# EAGLE design Barcode_Interface (EAGLE 5.10)
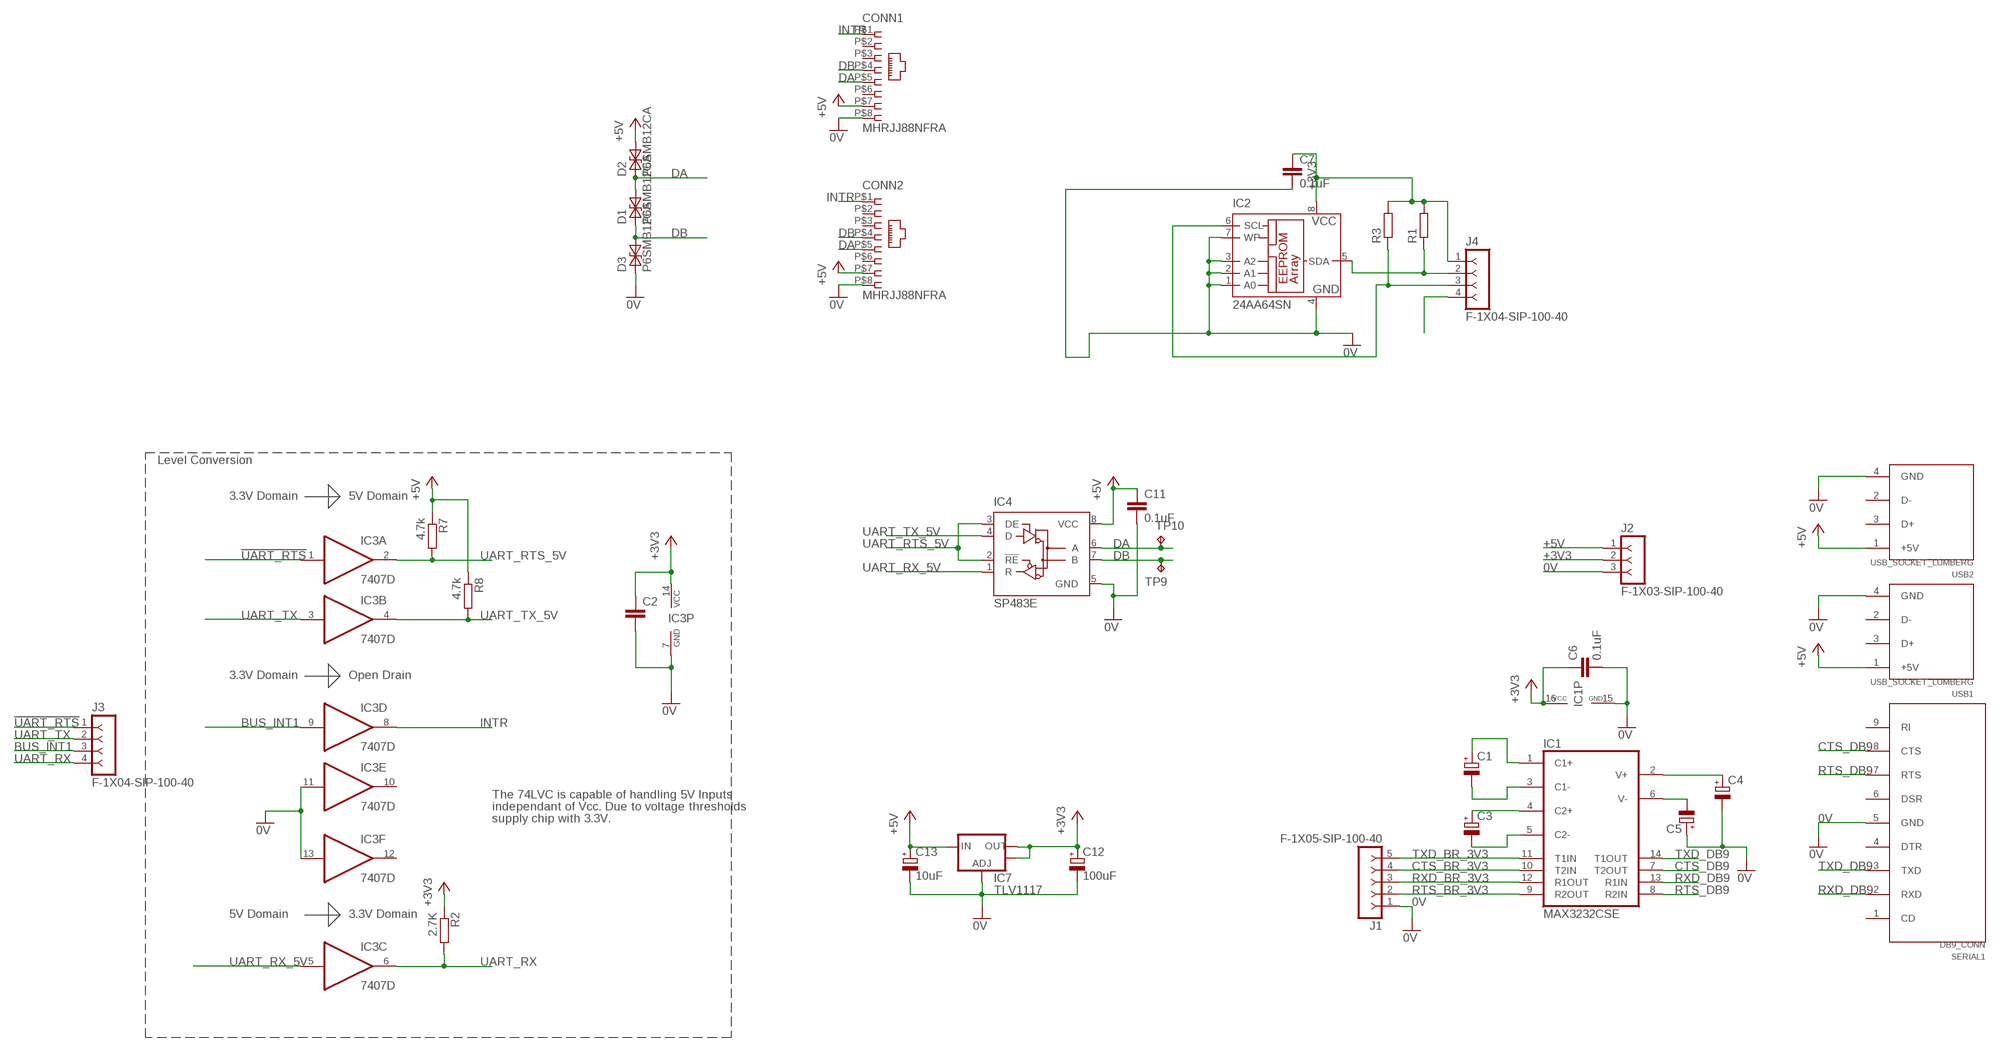
[diagram p0: schematic, sheet 1]

## Parts
C1  CPOL-EUE3.5-8  [E3,5-8]
C2  C-EUC0603  [C0603]
C3  CPOL-EUE3.5-8  [E3,5-8]
C4  CPOL-EUE3.5-8  [E3,5-8]
C5  CPOL-EUE3.5-8  [E3,5-8]
C6  0.1uF  C-EUC1206  [C1206]
C7  0.1uF  C-EUC1206  [C1206]
C11  0.1uF  C-EUC1206  [C1206]
C12  100uF  CPOL-EUB/3528-21R  [B/3528-21R]
C13  10uF  CPOL-EUC/6032-28R  [C/6032-28R]
CONN1  MHRJJ88NFRA  [MHRJJ8NFRA]
CONN2  MHRJJ88NFRA  [MHRJJ8NFRA]
D1  P6SMB12CA  [SMB]
D2  P6SMB12CA  [SMB]
D3  P6SMB12CA  [SMB]
IC1  MAX3232CSE  [SO16]
IC2  24AA64SN  [SO-08]
IC3  7407D  [SO14]
IC4  SP483E  75176AD  [D_R-PDSO-G8]
IC7  TLV1117  V_REG_LM1117SOT223  [SOT223]
J1  F-1X05-SIP-100-40  [SIP-100-05-40]
J2  F-1X03-SIP-100-40  [SIP-100-03-40]
J3  F-1X04-SIP-100-40  [SIP-100-04-40]
J4  F-1X04-SIP-100-40  [SIP-100-04-40]
R1  R-EU_R0805  [R0805]
R2  2.7K  R-EU_R0805  [R0805]
R3  R-EU_R0805  [R0805]
R7  4.7k  R-EU_R0805  [R0805]
R8  4.7k  R-EU_R0805  [R0805]
SERIAL1  DB9_CONN  [DB9]
TP9  TPTP13R  [TP13R]
TP10  TPTP13R  [TP13R]
USB1  USB_SOCKET_LUMBERG  [USB_SOCKET_LUMBERG]
USB2  USB_SOCKET_LUMBERG  [USB_SOCKET_LUMBERG]

## Nets
0V: C2.2 C4.- C5.+ C6.2 C7.2 C11.2 C12.- C13.- CONN1.P$8 CONN2.P$8 D3.1 IC1.15(GND) IC2.1(A0) IC2.2(A1) IC2.3(A2) IC2.4(GND) IC2.7(WP) IC3.7(P:GND) IC3.11(E:I) IC3.13(F:I) IC4.5(GND) IC7.1(ADJ) J1.1 J2.3 SERIAL1.5(GND) USB1.4(GND) USB2.4(GND)
!UART_RTS!: IC3.1(A:I) J3.1
+3V3: C2.1 C6.1 C7.1 C12.+ IC1.16(VCC) IC2.8(VCC) IC3.14(P:VCC) IC7.2(OUT) IC7.4(OUT) J2.2 J4.1 R1.2 R2.1 R3.2
+5V: C11.1 C13.+ CONN1.P$7 CONN2.P$7 D2.2 IC4.8(VCC) IC7.3(IN) J2.1 R7.1 R8.1 USB1.1(+5V) USB2.1(+5V)
BUS_INT1: IC3.9(D:I) J3.3
CTS_BR_3V3: IC1.10(T2IN) J1.4
CTS_DB9: IC1.7(T2OUT) SERIAL1.8(CTS)
DA: CONN1.P$5 CONN2.P$5 D1.2 D2.1 IC4.6(A) TP10.TP
DB: CONN1.P$4 CONN2.P$4 D1.1 D3.2 IC4.7(B) TP9.TP
INTR: CONN1.P$1 CONN2.P$1 IC3.8(D:O)
N$1: C1.+ IC1.1(C1+)
N$2: C1.- IC1.3(C1-)
N$3: C3.+ IC1.4(C2+)
N$4: C3.- IC1.5(C2-)
N$5: IC2.5(SDA) J4.2 R1.1
N$6: IC2.6(SCL) J4.3 R3.1
N$7: C5.- IC1.6(V-)
N$8: C4.+ IC1.2(V+)
N$9: J4.4
RTS_BR_3V3: IC1.9(R2OUT) J1.2
RTS_DB9: IC1.8(R2IN) SERIAL1.7(RTS)
RXD_BR_3V3: IC1.12(R1OUT) J1.3
RXD_DB9: IC1.13(R1IN) SERIAL1.2(RXD)
TXD_BR_3V3: IC1.11(T1IN) J1.5
TXD_DB9: IC1.14(T1OUT) SERIAL1.3(TXD)
UART_RTS_5V: IC3.2(A:O) IC4.2(!RE) IC4.3(DE) R7.2
UART_RX: IC3.6(C:O) J3.4 R2.2
UART_RX_5V: IC3.5(C:I) IC4.1(R)
UART_TX: IC3.3(B:I) J3.2
UART_TX_5V: IC3.4(B:O) IC4.4(D) R8.2
Unconnected: CONN1.P$2 CONN1.P$3 CONN1.P$6 CONN2.P$2 CONN2.P$3 CONN2.P$6 IC3.10(E:O) IC3.12(F:O) SERIAL1.1(CD) SERIAL1.4(DTR) SERIAL1.6(DSR) SERIAL1.9(RI) USB1.2(D-) USB1.3(D+) USB2.2(D-) USB2.3(D+)

## Notes on the sheet
- Level Conversion
- 3.3V Domain | 5V Domain
- 3.3V Domain | Open Drain
- The 74LVC is capable of handling 5V Inputs
- independant of Vcc. Due to voltage thresholds
- supply chip with 3.3V.
- 5V Domain | 3.3V Domain

## Library data of the parts
C1 C3-C5 C12 C13 = resistor:CPOL-EU: POLARIZED CAPACITOR, European symbol
C2 C6 C7 C11 = resistor:C-EU: CAPACITOR, European symbol
CONN1 CONN2 = eko-parts:MHRJJ88NFRA: http://onecall.farnell.com/mh-connectors/mhrjj88nfra/socket-rj45-8p8c/dp/3938360
D1-D3 = _hhn_suppressor_SMAJ_SM6T_P6SMB:P6SMB*CA: P6SMBxxCA Series of bidirectional Transient Voltage Suppressor Diodes xx = Stand-off Voltage VR in Volts; PPmax = 600 W Case: SMB = DO 214 AA Note: Footprint acc. to ST specs; source: www.st.com Author: Dipl.-Ing. FH Rainer Bayer, www.ing-rb.de/hhn Feedback: rainer.bayer@hs-heilbronn.de
IC1 = maxim:MAX3232*: True RS-232 Transceivers 3.0V to 5.5V, Low-Power up to 1Mbps, Using Four 0.1µF External Capacitors Source: http://pdfserv.maxim-ic.com/en/ds/MAX3222-MAX3241.pdf
IC2 = microchip:24*: Serial EEPROM I2C
IC3 = 74xx-eu:74*07: Hex BUFFER, open collector high-voltage output
IC4 = 751xx:75176A: DIFFERENTIAL BUS TRANSCEIVER Source: http://focus.ti.com/lit/ds/symlink/sn75176a.pdf
IC7 = SparkFun:V_REG_LM1117: Voltage Regulator LM1117 Standard adjustable voltage regulator but in SMD form. Spark Fun Electronics SKU : COM-00595
J1 = con-headers-jp:F-1X05-: FEMALE HEADER
J2 = con-headers-jp:F-1X03-: FEMALE HEADER
J3 J4 = con-headers-jp:F-1X04-: FEMALE HEADER
R1-R3 R7 R8 = resistor:R-EU_: RESISTOR, European symbol
SERIAL1 = eko-parts:DB9_CONN
TP9 TP10 = testpad:TP: Test pad
USB1 USB2 = eko-parts:USB_SOCKET_LUMBERG: http://www.farnell.com/datasheets/57298.pdf http://onecall.farnell.com/lumberg/2410-06/socket-usb-type-a/dp/1308874

## Board
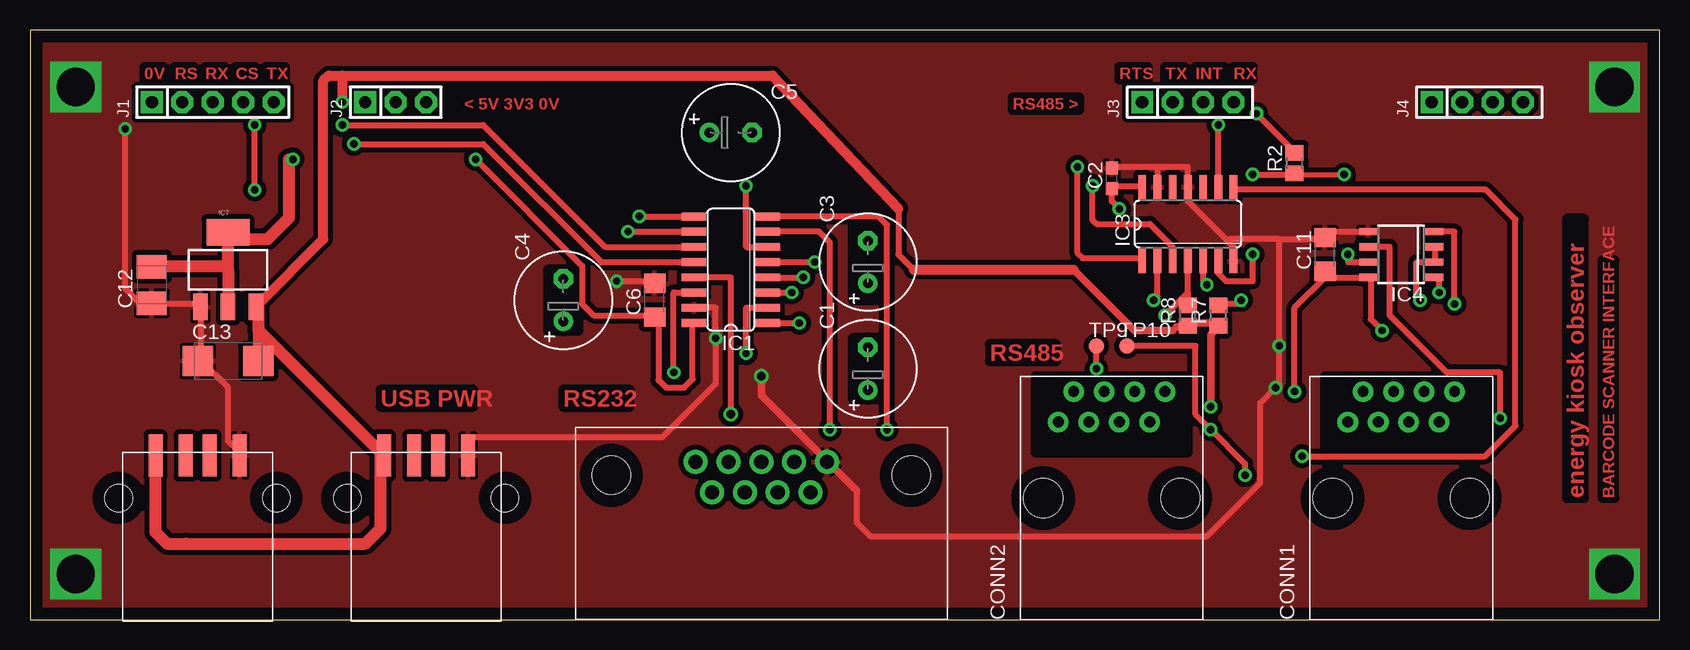
[diagram p1: board, top side]
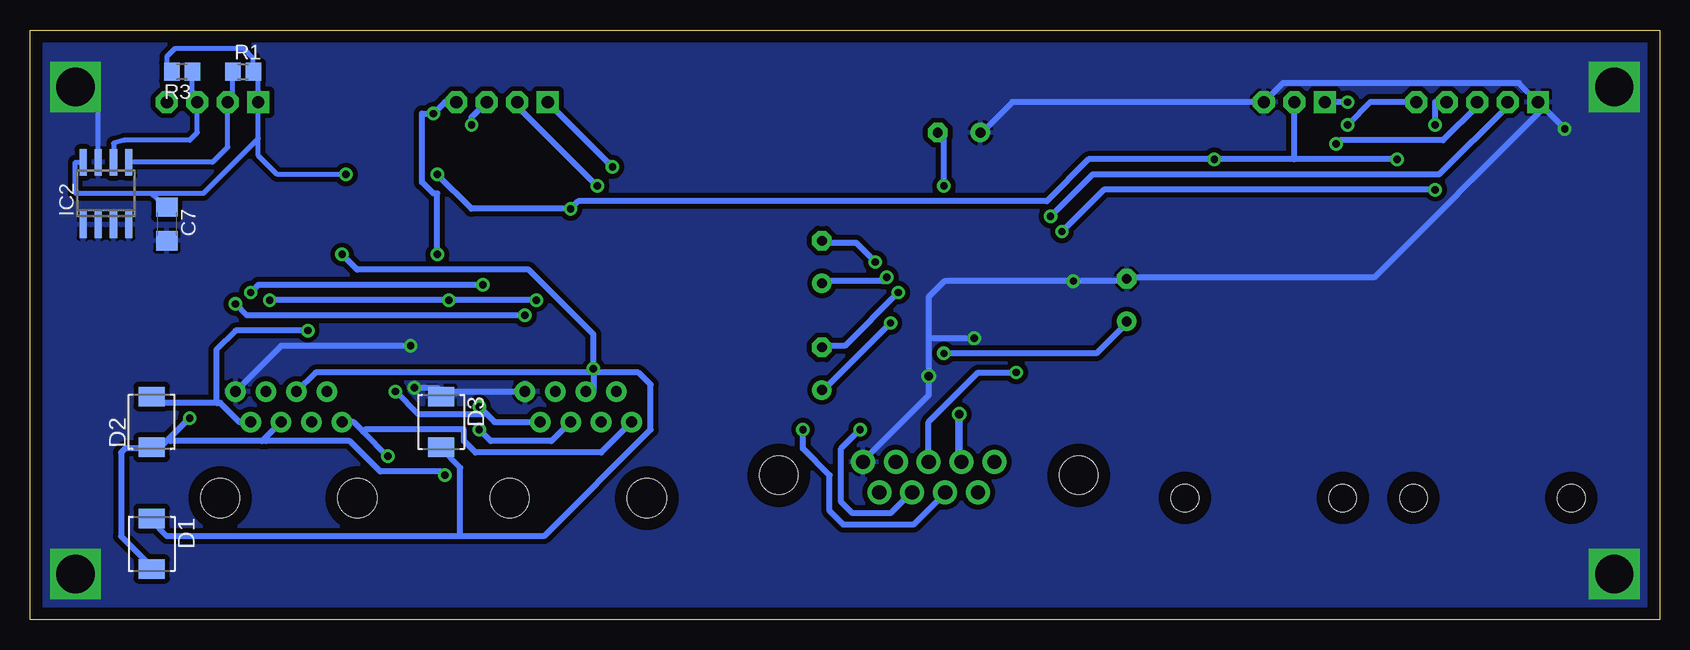
[diagram p2: board, bottom side, seen from below]

Size 135.87 x 49.2 mm. Coordinates in mm from the lower left corner, seen from the top.
Outline: 0,0 135.87,0 135.87,49.2 0,49.2 0,0
Copper layers (1*16): Top 0.035mm / dielectric 1.5mm / Bottom 0.035mm
Design rules "default *": minimum track width 16mil, minimum drill 24mil, track to track 16mil, track to pad 16mil, pad to pad 16mil, via to via 16mil, smd to smd 8mil, copper to edge 40mil, drill to drill 8mil, minimum pad ring 16mil, minimum via ring 10mil, stop-mask expansion 4mil, vias tented up to drill 0mil, thermal gap 10mil
tRestrict: area 83.8,14 to 96.5,20.3; area 108,14 to 120.7,20.3; area 68.6,26.7 to 71.1,33; area 43.2,24.1 to 45.7,29.2; area 68.6,18.4 to 71.1,23.5; area 55.9,39.4 to 61,41.9; area 91.4,41.9 to 101.6,44.5; area 26.7,41.9 to 34.3,44.5; area 8.9,41.9 to 21.6,44.5
vRestrict: area 26.7,0 to 39.4,14; area 7.6,0 to 20.3,14; area 82.5,0 to 97.8,20.3; area 106.7,0 to 121.9,20.3; area 57.2,24.1 to 59.7,34.3; area 91.4,31.7 to 101.6,34.3; area 111.8,27.9 to 116.8,33; area 66,16.5 to 73.7,25.4; area 66,25.4 to 73.7,34.3; area 39.4,22.9 to 48.3,30.5; area 53.3,36.8 to 62.2,44.5; area 12.7,27.9 to 20.3,30.5

### Footprints (pad centres in the part's own frame; a part is rotated, then mirrored left to right if it is on the bottom)
E3,5-8 = drill 0.813 pad 1.6 round: + -1.778,0 | drill 0.813 pad 1.6 octagon: - 1.778,0
C0603 = smd 1.1 x 1: 1 -0.85,0; 2 0.85,0
C1206 = smd 1.6 x 1.8: 1 -1.4,0; 2 1.4,0
B/3528-21R = smd 1.95 x 2.5: + 1.525,0; - -1.525,0
C/6032-28R = smd 2.55 x 2.5: + 2.525,0; - -2.525,0
MHRJJ8NFRA = drill 0.9 round: P$1 -4.445,6.35; P$2 -3.175,8.89; P$3 -1.905,6.35; P$4 -0.635,8.89; P$5 0.635,6.35; P$6 1.905,8.89; P$7 3.175,6.35; P$8 4.445,8.89 | hole 3.25: -5.715,0; 5.715,0
SMB = smd 1.62 x 2.18: 1 -2.11,0; 2 2.11,0
SO16 = smd 0.66 x 2.032: 1 -4.445,-3.073; 2 -3.175,-3.073; 3 -1.905,-3.073; 4 -0.635,-3.073; 5 0.635,-3.073; 6 1.905,-3.073; 7 3.175,-3.073; 8 4.445,-3.073; 9 4.445,3.073; 10 3.175,3.073; 11 1.905,3.073; 12 0.635,3.073; 13 -0.635,3.073; 14 -1.905,3.073; 15 -3.175,3.073; 16 -4.445,3.073
SO-08 = smd 0.6 x 2.2: 1 -1.905,-2.6; 2 -0.635,-2.6; 3 0.635,-2.6; 4 1.905,-2.6; 5 1.905,2.6; 6 0.635,2.6; 7 -0.635,2.6; 8 -1.905,2.6
SO14 = smd 0.66 x 2.032: 1 -3.81,-3.073; 2 -2.54,-3.073; 3 -1.27,-3.073; 4 0,-3.073; 5 1.27,-3.073; 6 2.54,-3.073; 7 3.81,-3.073; 8 3.81,3.073; 9 2.54,3.073; 10 1.27,3.073; 11 0,3.073; 12 -1.27,3.073; 13 -2.54,3.073; 14 -3.81,3.073
D_R-PDSO-G8 = smd 0.6 x 1.5: 1 -1.905,-2.75; 2 -0.635,-2.75; 3 0.635,-2.75; 4 1.905,-2.75; 5 1.905,2.75; 6 0.635,2.75; 7 -0.635,2.75; 8 -1.905,2.75
SOT223 = smd 1.219 x 2.235: 1 -2.311,-3.099; 2 0,-3.099; 3 2.311,-3.099 | smd 3.6 x 2.2: 4 0,3.099
SIP-100-05-40 = drill 1.016 pad 1.778 square: 1 -5.08,0 | drill 1.016 pad 1.778 octagon: 2 -2.54,0; 3 0,0; 4 2.54,0; 5 5.08,0
SIP-100-03-40 = drill 1.016 pad 1.778 square: 1 -2.54,0 | drill 1.016 pad 1.778 octagon: 2 0,0; 3 2.54,0
SIP-100-04-40 = drill 1.016 pad 1.778 square: 1 -3.81,0 | drill 1.016 pad 1.778 octagon: 2 -1.27,0; 3 1.27,0; 4 3.81,0
R0805 = smd 1.3 x 1.5: 1 -0.85,0; 2 0.85,0
DB9 = drill 1.19 round: 1 5.48,-1.12; 2 2.74,-1.12; 3 0,-1.12; 4 -2.74,-1.12; 5 -5.48,-1.12; 6 4.11,1.42; 7 1.37,1.42; 8 -1.37,1.42; 9 -4.11,1.42 | hole 3.2: -12.5,0; 12.5,0
TP13R = smd 1.3 x 1.3: TP 0,0
USB_SOCKET_LUMBERG = smd 1.15 x 3.5: 1 -3.5,3.56; 2 -1,3.56; 3 1,3.56; 4 3.5,3.56 | hole 2.3: -6.57,0; 6.57,0

### Placement (x,y rotation side)
C1  69.85,20.95 90 top
C2  90.17,36.83 90 top
C3  69.85,29.84 90 top
C4  44.45,26.67 90 top
C5  58.42,40.64 0 top
C6  52.07,26.67 90 top
C7  124.46,33.02 270 bottom
C11  107.95,30.48 90 top
C12  10.16,27.94 90 top
C13  16.51,21.59 0 top
CONN1  114.3,10.16 0 top
CONN2  90.17,10.16 0 top
D1  125.73,6.35 270 bottom
D2  125.73,16.51 90 bottom
D3  101.6,16.51 270 bottom
IC1  58.42,29.21 90 top
IC2  129.54,35.56 0 bottom
IC3  96.52,33.02 0 top
IC4  114.3,30.48 90 top
IC7  16.51,29.21 0 top
J1  15.24,43.18 0 top
J2  30.48,43.18 0 top
J3  96.52,43.18 0 top
J4  120.65,43.18 0 top
R1  118.11,45.72 0 bottom
R2  105.41,38.1 90 top
R3  123.19,45.72 180 bottom
R7  99.06,25.4 90 top
R8  96.52,25.4 90 top
SERIAL1  60.96,12.06 180 top
TP9  88.9,22.86 0 top
TP10  91.44,22.86 0 top
USB1  13.97,10.16 0 top
USB2  33.02,10.16 0 top

### Tracks (layer width: path | path; a pad name or v marks a point on that pad's centre or on a via)
0V  (via drill 0.61, 0.7, 3.2)
  Top 0.508: 14.29,21.59 14.29,26.04 IC7.1 13.97,26.35 10.16,26.35 C12.- 10.16,26.67 8.89,26.67 7.94,27.62 v7.94,40.96 | 14.29,21.59 16.51,19.37 16.51,14.92 17.46,13.97 USB1.4 | 14.29,21.59 C13.- | 93.98,37.78 90.17,37.78 C2.2 | 93.98,37.78 IC3.13 | IC4.5 107.95,32.38 C11.2 107.95,31.75 104.14,31.75 | 99.85,31.59 100.33,31.11 IC3.7 | 99.85,31.59 96.52,34.92 IC3.11 96.52,37.78 93.98,37.78 | 104.14,31.75 100.01,31.75 99.85,31.59 | 104.14,31.75 v104.14,22.86 104.14,19.68 v103.82,19.37 102.55,18.1 102.55,11.43 98.11,6.99 70.04,6.99 68.9,8.13 68.9,10.79 | IC1.15 57.15,26.04 v57.15,23.5 57.15,19.68 52.7,15.24 36.83,15.24 36.83,13.97 USB2.4 | v48.9,28.26 52.07,28.26 C6.2
  Top 0.61: v60.96,20.32 60.96,18.73 68.9,10.79
  Bottom 0.406: IC2.7 130.18,42.55 132.08,42.55 v132.08,44.45
  Bottom 0.508: C5.+ 56.52,40.64 53.98,43.18 J2.3 31.43,44.77 11.75,44.77 J1.1 | v7.94,40.96 J1.1 | CONN2.P$8 101.28,19.05 101.6,18.73 D3.1 101.6,19.05 101.92,19.37 v103.82,19.37 | CONN1.P$8 114.94,22.86 v104.14,22.86 | 60.96,23.5 v60.96,20.32 60.96,18.73 66.36,13.34 SERIAL1.5 | 60.96,23.5 60.96,26.95 59.65,28.26 v48.9,28.26 44.45,28.26 C4.- 44.45,28.57 23.81,28.57 9.84,42.55 J1.1 | 60.96,23.5 v57.15,23.5
  other vias: 3.81,44.45 3.81,3.81 132.08,3.81
  pour Bottom (isolate 0.406): 0,49.53 135.89,49.53 135.89,0 0,0
  pour Top (isolate 0.406): 0,49.53 135.89,49.53 135.89,0 0,0
!UART_RTS!  (via drill 0.61)
  Top 0.508: v87.31,37.78 87.31,30.61 87.76,30.16 92.71,30.16 IC3.1
  Bottom 0.508: v87.31,37.78 J3.1
+3V3  (via drill 0.61)
  Top 0.406: 105.41,37.15 v109.54,37.15
  Top 0.508: IC3.14 92.71,36.2 90.17,36.2 C2.1 90.17,34.92 v90.81,34.29 | v101.92,37.15 105.41,37.15 R2.1 | IC1.16 55.24,24.77 55.24,20.08 54.53,19.37 53.02,19.37 52.39,20 52.39,24.77 52.07,25.08 C6.1 52.07,25.4 46.99,25.4 46.04,26.35 46.04,29.53 v37.15,38.42 | 16.51,29.53 16.51,29.21 | 17.78,31.75 IC7.4 16.51,32.07 | C12.+ 10.16,29.53
  Top 0.813: 21.59,38.42 v21.91,38.42 | 16.51,31.75 IC7.4
  Top 1.016: IC7.2 16.51,29.21 16.51,31.75 19.79,31.75 21.59,33.55 21.59,38.42 | 10.16,29.53 16.51,29.53
  Bottom 0.406: R3.2 124.46,45.72 124.46,46.99 123.83,47.62 118.02,47.62 117.26,46.86 R1.2 116.84,45.72 J4.1 116.84,40.14 | IC2.8 132.08,38.16 132.08,35.56 125.73,35.56 | 125.73,35.56 121.42,35.56 116.84,40.14 | v109.54,37.15 115.25,37.15 116.84,38.73 116.84,40.14 | 125.73,35.56 C7.1
  Bottom 0.508: v101.92,37.15 99.06,34.29 v90.81,34.29 90.17,34.92 51.12,34.92 47.62,38.42 v37.15,38.42 30.48,38.42 | 30.48,38.42 J2.2 | v21.91,38.42 30.48,38.42
+5V  (via drill 0.61)
  Top 0.508: 107.95,28.57 IC4.8 111.76,28.57 111.76,25.08 v112.71,24.13 | 107.95,28.57 C11.1 107.95,28.89 | 99.06,24.77 R7.1 | 107.95,28.57 105.41,26.04 v105.41,19.05 | USB1.1 10.48,13.65 | 29.21,13.65 USB2.1 29.21,13.97 | 19.05,26.04 IC7.3 19.05,26.35 | 95.25,24.13 95.57,24.45 | 72.39,34.29 72.39,30.48 73.66,29.21 | 96.52,24.45 R8.1
  Top 0.61: 99.06,24.77 96.52,24.77 R8.1 | v98.42,17.78 98.42,23.81 99.06,24.45 R7.1 | 95.57,24.45 96.52,24.45 | 95.25,24.13 92.08,24.13 87,29.21
  Top 0.813: 19.05,26.35 24.45,31.75 24.45,44.95 24.9,45.4 26.04,45.4 | 73.66,29.21 87,29.21 | 72.39,34.29 61.91,45.4 26.04,45.4 | 26.04,45.4 v26.04,43.18
  Top 1.016: 29.21,13.65 29.21,8.89 29.21,7.62 27.94,6.35 13.02,6.35 11.43,6.35 10.47,7.31 10.47,9.21 USB1.1 | 19.05,24.13 C13.+ | 19.05,24.13 19.05,26.04 | 29.21,13.97 19.05,24.13
  Bottom 0.508: 120.33,18.1 120.02,18.1 118.43,16.51 CONN1.P$7 | 120.33,18.1 125.41,18.1 125.73,18.41 D2.2 | 97.95,17.3 97.16,16.51 CONN2.P$7 | v98.42,17.78 97.95,17.3 | v105.41,19.05 103.5,17.14 98.11,17.14 97.95,17.3 | v112.71,24.13 118.75,24.13 120.33,22.54 120.33,18.1 | v26.04,43.18 J2.1
BUS_INT1  (via drill 0.61)
  Top 0.508: IC3.9 v99.06,41.27
  Bottom 0.508: v99.06,41.27 99.06,41.91 J3.3
CTS_BR_3V3  (via drill 0.61)
  Top 0.508: v18.73,35.88 v18.73,41.27 | v49.85,32.38 IC1.10
  Bottom 0.508: v49.85,32.38 46.35,35.88 v18.73,35.88 | v18.73,41.27 18.73,43.18 J1.4
CTS_DB9  (via drill 0.61)
  Top 0.508: v66.67,15.88 66.67,31.49 65.78,32.38 IC1.7
  Bottom 0.508: v66.67,15.88 68.26,14.29 68.26,9.84 67.31,8.89 64.14,8.89 62.55,10.48 SERIAL1.8
DA  (via drill 0.61)
  Top 0.508: TP10.TP 97.16,22.86 97.16,17.14 v98.42,15.88 101.28,13.02 v101.28,12.06 | v122.56,16.83 122.56,20.64 118.11,20.64 113.35,25.4 113.35,31.11 IC4.6
  Bottom 0.508: v98.42,15.88 97.47,14.92 92.39,14.92 CONN2.P$5 | 124.3,15.08 124.78,14.61 125.73,14.61 D2.1 125.73,14.29 127.95,14.29 128.27,13.97 128.27,6.99 125.73,4.45 D1.2 | 124.3,15.08 v122.56,16.83 | 116.36,15.08 116.52,14.92 124.14,14.92 124.3,15.08 | 116.36,15.08 CONN1.P$5 | v101.28,12.06 101.6,12.38 106.68,12.38 109.22,14.92 116.2,14.92 116.36,15.08
DB  (via drill 0.61)
  Top 0.508: v88.9,20.95 TP9.TP | v109.86,30.48 109.86,29.84 IC4.7
  Bottom 0.508: 100.01,6.99 100.01,12.7 101.6,14.29 D3.2 | 100.01,6.99 124.46,6.99 125.73,8.26 D1.1 | 88.9,20.64 88.9,19.05 CONN2.P$4 | v109.86,30.48 108.58,29.21 94.3,29.21 88.9,23.81 v88.9,20.95 88.9,20.64 | CONN1.P$4 112.08,20.64 88.9,20.64 | 100.01,6.99 93.03,6.99 84.14,15.88 84.14,19.63 85.14,20.64 88.9,20.64
INTR  (via drill 0.61)
  Top 0.508: v106.05,13.65 121.28,13.65 123.83,16.19 123.83,33.4 121.34,35.88 100.33,35.88 IC3.8
  Bottom 0.508: 108.11,15.72 108.9,16.51 CONN1.P$1 | 108.11,15.72 v106.05,13.65 | CONN2.P$1 88.27,13.97 98.74,13.97 99.69,14.92 99.69,15.88 107.95,15.88 108.11,15.72
N$1  (via drill 0.61)
  Top 0.508: IC1.1 v64.14,24.77
  Bottom 0.508: v64.14,24.77 69.53,19.37 69.85,19.37 C1.+
N$2  (via drill 0.61)
  Top 0.508: IC1.3 v63.5,27.3
  Bottom 0.508: v63.5,27.3 67.94,22.86 69.85,22.86 C1.-
N$3  (via drill 0.61)
  Top 0.508: IC1.4 v64.45,28.57
  Bottom 0.508: v64.45,28.57 64.77,28.26 69.85,28.26 C3.+
N$4  (via drill 0.61)
  Top 0.508: IC1.5 v65.41,29.84
  Bottom 0.508: v65.41,29.84 66.99,31.43 69.85,31.43 C3.-
N$5
  Bottom 0.406: R1.1 118.96,43.18 J4.2 119.38,39.43 120.65,38.16 IC2.5
N$6
  Bottom 0.406: R3.1 122.34,43.18 J4.3 121.92,40.64 122.56,40.01 128.01,40.01 128.91,39.74 IC2.6
N$7  (via drill 0.61)
  Top 0.508: v59.69,36.2 59.69,31.11 IC1.6
  Bottom 0.508: v59.69,36.2 59.69,40.64 C5.-
N$8  (via drill 0.61)
  Top 0.508: v59.69,22.23 59.69,26.04 IC1.2
  Bottom 0.508: v59.69,22.23 46.99,22.23 44.45,24.77 C4.+
RTS_BR_3V3  (via drill 0.61)
  Top 0.508: v50.8,33.66 IC1.9
  Bottom 0.508: v50.8,33.66 47.31,37.15 18.41,37.15 12.7,42.86 J1.2
RTS_DB9  (via drill 0.61)
  Top 0.508: v71.44,15.88 71.44,32.95 70.73,33.66 IC1.8
  Bottom 0.508: v71.44,15.88 71.44,14.29 69.22,12.06 69.22,9.08 68.07,7.94 62.23,7.94 59.69,10.48 SERIAL1.7
RXD_BR_3V3  (via drill 0.61)
  Top 0.508: v26.99,39.69 37.78,39.69 47.62,29.84 IC1.12
  Bottom 0.508: v26.99,39.69 26.67,40.01 18.1,40.01 15.24,42.86 J1.3
RXD_DB9  (via drill 0.7)
  Top 0.508: v58.42,17.14 58.42,28.57 IC1.13
  Bottom 0.61: SERIAL1.2 58.42,13.19 v58.42,17.14
TXD_BR_3V3  (via drill 0.61)
  Top 0.508: v26.04,41.27 37.78,41.27 47.94,31.11 IC1.11
  Bottom 0.508: v26.04,41.27 24.13,43.18 J1.5
TXD_DB9  (via drill 0.61)
  Top 0.508: v53.66,20.64 53.66,27.3 IC1.14
  Bottom 0.508: v53.66,20.64 56.83,20.64 60.96,16.51 60.96,13.34 SERIAL1.3
UART_RTS_5V  (via drill 0.61)
  Top 0.508: IC4.3 117.16,31.11 117.16,29.84 IC4.2 115.57,29.84 115.57,26.99 v115.89,26.67 | v100.97,26.67 100.97,26.35 99.06,26.35 R7.2 | v93.66,26.67 93.98,26.99 IC3.2
  Bottom 0.508: v93.66,26.67 v100.97,26.67 v115.89,26.67
UART_RX  (via drill 0.61)
  Top 0.508: v102.23,42.23 105.41,39.05 R2.2 | v101.92,30.48 101.92,28.26 99.69,28.26 99.06,28.89 IC3.6
  Bottom 0.508: J3.4 101.28,43.18 v102.23,42.23 103.19,42.23 103.19,36.51 102.23,35.56 101.92,35.56 v101.92,30.48
UART_RX_5V  (via drill 0.61)
  Top 0.508: v117.47,27.3 117.47,28.26 117.16,28.57 IC4.1 | v98.11,27.94 97.79,28.26 IC3.5
  Bottom 0.508: v117.47,27.3 116.84,27.94 v98.11,27.94
UART_TX  (via drill 0.61)
  Top 0.508: v88.58,36.2 88.58,33.34 88.9,33.02 93.34,33.02 95.25,31.11 IC3.3
  Bottom 0.508: v88.58,36.2 95.25,42.86 J3.2
UART_TX_5V  (via drill 0.61)
  Top 0.508: 96.52,27.3 R8.2 | 96.52,27.3 IC3.4 | v118.75,26.35 118.75,32.38 IC4.4 | v94.61,25.4 96.52,27.3
  Bottom 0.508: v118.75,26.35 117.79,25.4 v94.61,25.4

### Text on the board
Top: 0V | RS | RX | CS | TX | RTS | TX | INT | RX | < 5V 3V3 0V | RS485 > | RS485 | USB PWR | RS232 | energy kiosk observer | BARCODE SCANNER INTERFACE